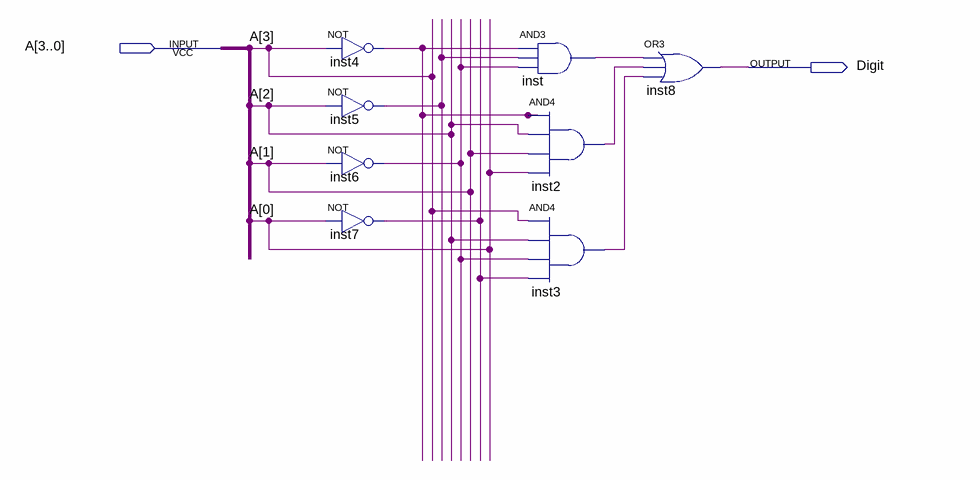
[diagram p0: schematic sheet]
// Quartus schematic sevensegment6.bdf as structural Verilog: 8 symbols, 2 pins
module sevensegment6 (
  input  [3:0] A,
  output Digit
);

  wire inst2_out, inst3_out, inst4_out, inst5_out, inst6_out, inst7_out, inst_out;

  not inst4 (inst4_out, A[3]);
  not inst5 (inst5_out, A[2]);
  not inst6 (inst6_out, A[1]);
  not inst7 (inst7_out, A[0]);
  and inst (inst_out, inst4_out, inst5_out, inst6_out);
  and inst2 (inst2_out, inst4_out, A[2], A[1], A[0]);
  and inst3 (inst3_out, A[3], A[2], inst6_out, inst7_out);
  or inst8 (Digit, inst_out, inst2_out, inst3_out);
endmodule
